# Altium project altium.PrjPcb
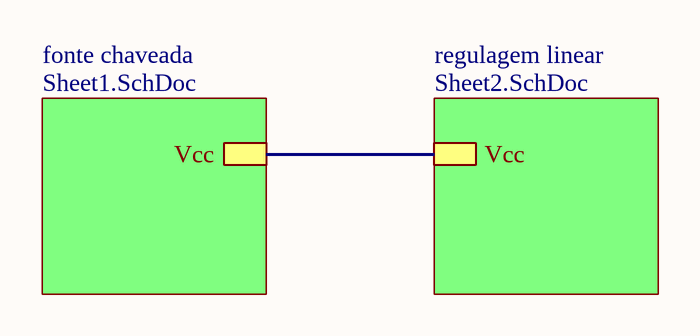
[diagram p0: main.SchDoc]
3 sheets, 44 parts. Net scope: hierarchical (ports join the sheet entries above them; power ports are global).
Board file: PCB1.PcbDoc
Sheets:
  main.SchDoc
    fonte chaveada = Sheet1.SchDoc
    regulagem linear = Sheet2.SchDoc

## Sheet main.SchDoc
size A4

### Sub-sheets
fonte chaveada = Sheet1.SchDoc: Vcc
regulagem linear = Sheet2.SchDoc: Vcc

### Nets
Net*1_K: sheet fonte chaveada/Vcc, sheet regulagem linear/Vcc

## Sheet Sheet1.SchDoc
size A4
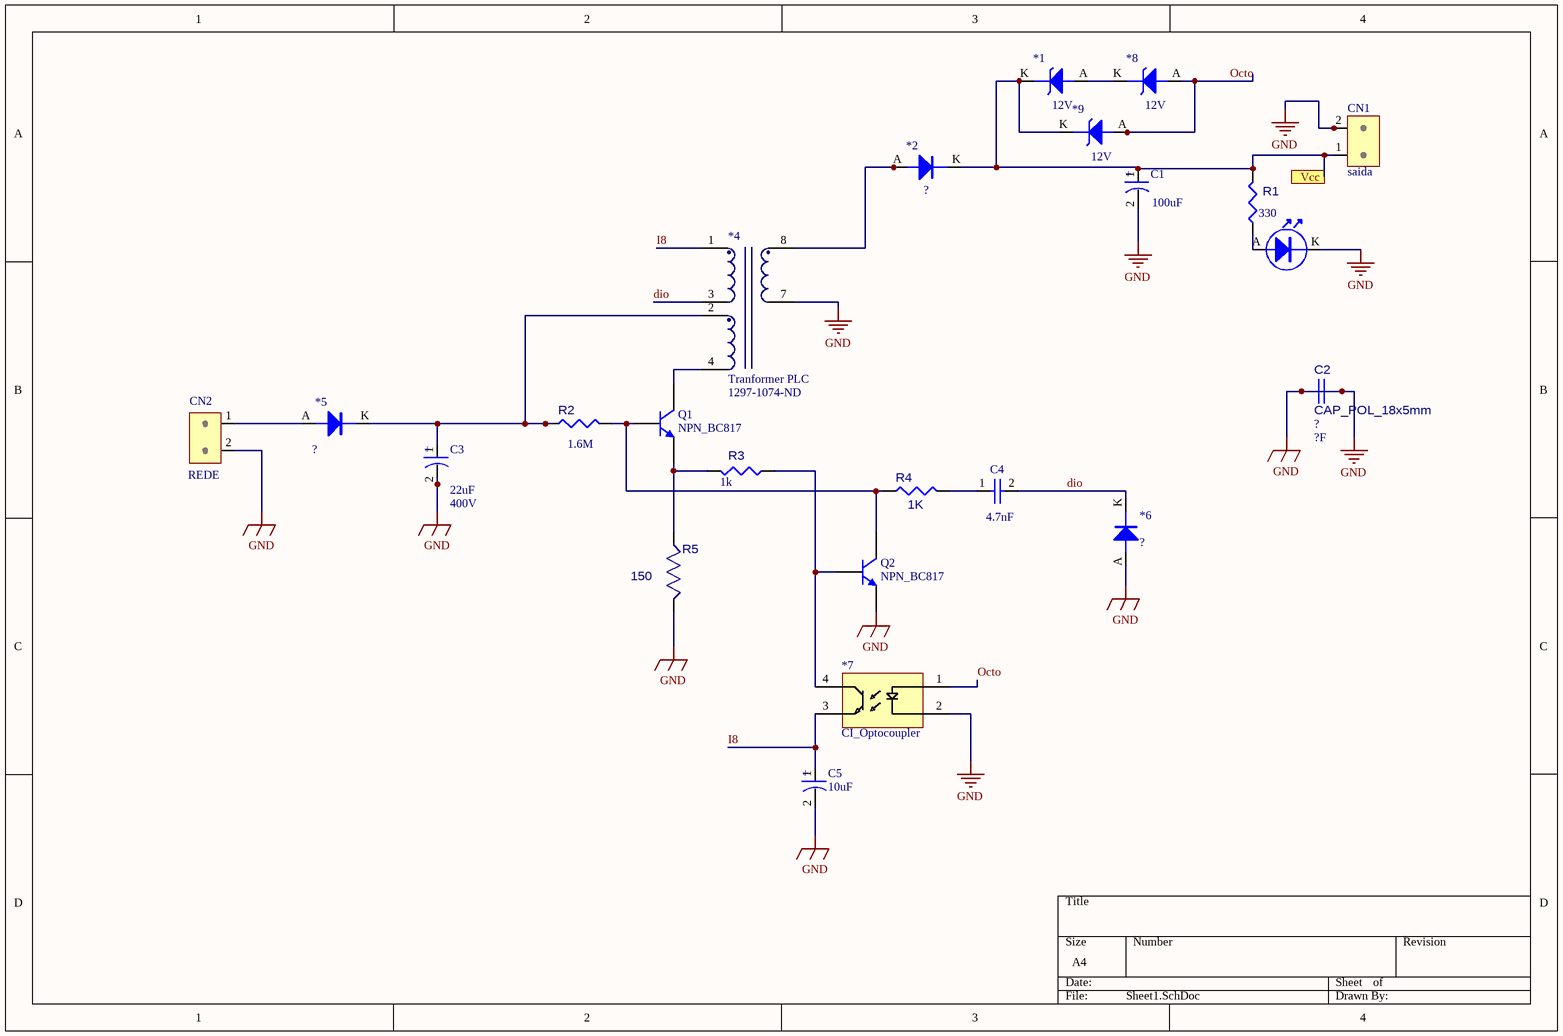
[diagram p1: Sheet1.SchDoc]

### Parts
*1  value 12V  [DIO_PTH_DO35]  (hidden comment: DIO_ZENER_DO35)
*2  DIO_PTH_1N4007  [DIO_PTH_DO41]  (value not drawn)
*3  LED_AXIAL_5MM  [LED_Axial_5mm]  (value not drawn)
*4  Tranformer PLC  Supplier Part Number 1: 1297-1074-ND  [DIV_TRAFO PLC]
*5  DIO_SMD_1N4148  [DIO_PTH_DO41]  (value not drawn)
*6  DIO_PTH_1N4007  [DIO_PTH_DO41]  (value not drawn)
*7  CI_Optocoupler  [SFH6106]
*8  value 12V  [DIO_PTH_DO35]  (hidden comment: DIO_ZENER_DO35)
*9  value 12V  [DIO_PTH_DO35]  (hidden comment: DIO_ZENER_DO35)
C1  value 100uF  [CAP_ALU_RADIAL_5MM]  (hidden comment: Electrolytic Capacitor)
C2  ?F  [CAP_POL_18x5mm]
C3  value 22uF  Tensão: 400V  [CAP_ALU_RADIAL_5MM]  (hidden comment: Electrolytic Capacitor)
C4  value 4.7nF  [CAP_POL_RADIAL_16MM]  (hidden comment: CAP_POL_RADIAL_16MM)
C5  10uF  [CAP_ALU_RADIAL_5MM]
CN1  saida  [CN_KRE_2]
CN2  Footprint: REDE  [CN_KRE_2]  (hidden comment: ?)
Q1  NPN_BC817  [HEADER_1X3]
Q2  NPN_BC817  [HEADER_1X3]
R1  330  [RES_PTH_7.62MM]
R2  1.6M  [RES_PTH_7.62MM]
R3  1k  [RES_PTH_7.62MM]
R4  Footprint: 1K  [RES_PTH_7.62MM]  (hidden comment: ?)
R5  Footprint: 150  [RES-7.62mm]  (hidden comment: *)

### Ports
Vcc

### Nets
GND: *3.K *4.7 *6.A *7.2(C) C1.2 C2.1 C2.2 C3.2 C5.2 CN1.2 CN2.2 Q2.2(E) R5.2
dio: *4.3 *6.K C4.2
I8: *4.1 *7.3(C) C5.1
Octo: *7.1(A) *8.A *9.A
Net*1_A: *1.A *8.K
Net*1_K: *1.K *2.K *9.K C1.1 CN1.1 R1.2 ; port Vcc
Net*2_A: *2.A *4.8
Net*3_A: *3.A R1.1
Net*4_2: *4.2 *5.K C3.1 R2.1
Net*4_4: *4.4 Q1.3(C)
Net*5_A: *5.A CN2.1
Net*7_4: *7.4(E) Q2.1(B) R3.1
NetC4_1: C4.1 R4.2
NetQ1_1: Q1.1(B) Q2.3(C) R2.2 R4.1
NetQ1_2: Q1.2(E) R3.2 R5.1

### Notes on the sheet
- (in symbol CAP_ALU_RADIAL_5MM) +

### Library data of the parts
C1 C3 = CAP_ALU_RADIAL_5MM: PTH Radial Electrolytic Capacitor
  C1: Tensão: ?
C2 = CAP_CER_POLI_18x5mm: SMD Ceramic Capacitor; Tensão: ?; Value: ?F
C4 = CAP_POL_RADIAL_16MM: PTH Radial Polyester Capacitor; Tensão: ?
C5 = CAP_ALU_RADIAL_5MM: PTH Radial Electrolytic Capacitor; Value: ?F; Tensão: ?
CN1 CN2 = CN_MKDS_2: MKDS_2; Value: ?
Q2 = NPN_BC817: pin to pad: 1>2 2>1
R1-R4 = RES_PTH_7.62MM: Pin Through Hole Resistor 7.62mm
  R1: Value: 330
  R2: Value: 1.6M
  R3: Value: 1k
  R4: Value: ?
R5 = RES_PTH300: Pin Through Hole Resistor 300mils/7.62mm; Value: *
*2 *6 = DIO_PTH_1N4007: Value: ?
*3 = LED_AXIAL_5MM: Value: ?
*4 = Tranformer PLC: Supplier 1: Digi-Key
*5 = DIO_SMD_1N4148: Value: ?

## Sheet Sheet2.SchDoc
size A4
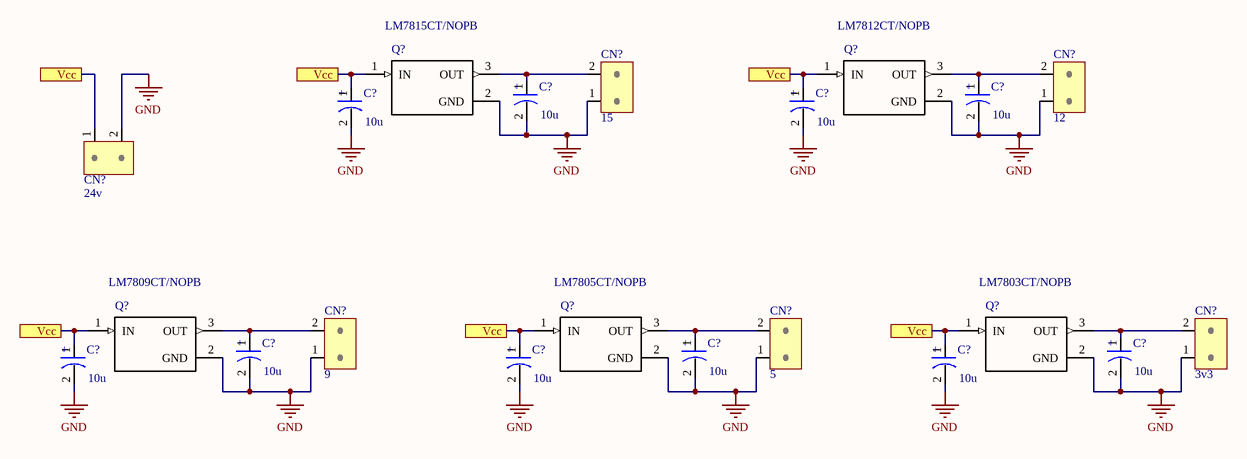
[diagram p2: Sheet2.SchDoc]

### Parts
(Parts that share a designator on the sheet are numbered #1, #2 ... from top to bottom, then left to right.)
C?#1  value 10u  [CAP_ALU_RADIAL_5MM]  (hidden comment: Electrolytic Capacitor)
C?#2  value 10u  [CAP_ALU_RADIAL_5MM]  (hidden comment: Electrolytic Capacitor)
C?#3  value 10u  [CAP_ALU_RADIAL_5MM]  (hidden comment: Electrolytic Capacitor)
C?#4  value 10u  [CAP_ALU_RADIAL_5MM]  (hidden comment: Electrolytic Capacitor)
C?#5  value 10u  [CAP_ALU_RADIAL_5MM]  (hidden comment: Electrolytic Capacitor)
C?#6  value 10u  [CAP_ALU_RADIAL_5MM]  (hidden comment: Electrolytic Capacitor)
C?#7  value 10u  [CAP_ALU_RADIAL_5MM]  (hidden comment: Electrolytic Capacitor)
C?#8  value 10u  [CAP_ALU_RADIAL_5MM]  (hidden comment: Electrolytic Capacitor)
C?#9  value 10u  [CAP_ALU_RADIAL_5MM]  (hidden comment: Electrolytic Capacitor)
C?#10  value 10u  [CAP_ALU_RADIAL_5MM]  (hidden comment: Electrolytic Capacitor)
CN?#1  15  [CN_KRE_2]
CN?#2  12  [CN_KRE_2]
CN?#3  24v  [CN_KRE_2]
CN?#4  9  [CN_KRE_2]
CN?#5  5  [CN_KRE_2]
CN?#6  3v3  [CN_KRE_2]
Q?#1  LM7815CT/NOPB  [*TO254P1054X470X2600-3]
Q?#2  LM7812CT/NOPB  [*TO254P1054X470X2600-3]
Q?#3  LM7809CT/NOPB  [*TO254P1054X470X2600-3]
Q?#4  LM7805CT/NOPB  [*TO254P1054X470X2600-3]
Q?#5  LM7803CT/NOPB  [*TO254P1054X470X2600-3]

### Ports
Vcc

### Nets
GND: C?#1.2 C?#2.2 C?#3.2 C?#4.2 C?#5.2 C?#6.2 C?#7.2 C?#8.2 C?#9.2 C?#10.2 CN?#1.1 CN?#2.1 CN?#3.2 CN?#4.1 CN?#5.1 CN?#6.1 Q?#1.2(GND) Q?#2.2(GND) Q?#3.2(GND) Q?#4.2(GND) Q?#5.2(GND)
Net*1_K: C?#3.1 C?#4.1 C?#8.1 C?#9.1 C?#10.1 CN?#3.1 Q?#1.1(IN) Q?#2.1(IN) Q?#3.1(IN) Q?#4.1(IN) Q?#5.1(IN) ; port Vcc
NetC?#1_1: C?#1.1 CN?#1.2 Q?#1.3(OUT)
NetC?#2_1: C?#2.1 CN?#2.2 Q?#2.3(OUT)
NetC?#5_1: C?#5.1 CN?#4.2 Q?#3.3(OUT)
NetC?#6_1: C?#6.1 CN?#5.2 Q?#4.3(OUT)
NetC?#7_1: C?#7.1 CN?#6.2 Q?#5.3(OUT)

### Notes on the sheet
- (in symbol CAP_ALU_RADIAL_5MM) +

### Library data of the parts
C?#1-C?#10 = CAP_ALU_RADIAL_5MM: PTH Radial Electrolytic Capacitor; Tensão: ?
CN?#1-CN?#6 = CN_MKDS_2: MKDS_2; Value: ?
Q?#1-Q?#5 = LM7805CT/NOPB: Linear Voltage Regulator IC Positive Fixed 1 Output 1A TO-220-3; MF: ON Semiconductor; Package: TO-220 ON Semiconductor; MP: LM7805CT; SnapEDA_Link: https://www.snapeda.com/parts/LM7805CT/ON%20Semiconductor/view-part/546231/?ref=snap; Availability: Unavailable; Price: None; Value: *

## Nets that join several sheets
GND: Sheet1 (13 pins), Sheet2 (21 pins)
Net*1_K: Sheet1 (6 pins), Sheet2 (11 pins)